# Altium schematic sheet Power.SchDoc: Power Supply
size A4; DrawnBy: A. Küllenberg; Revision: A; SheetNumber: 3; SheetTotal: 10
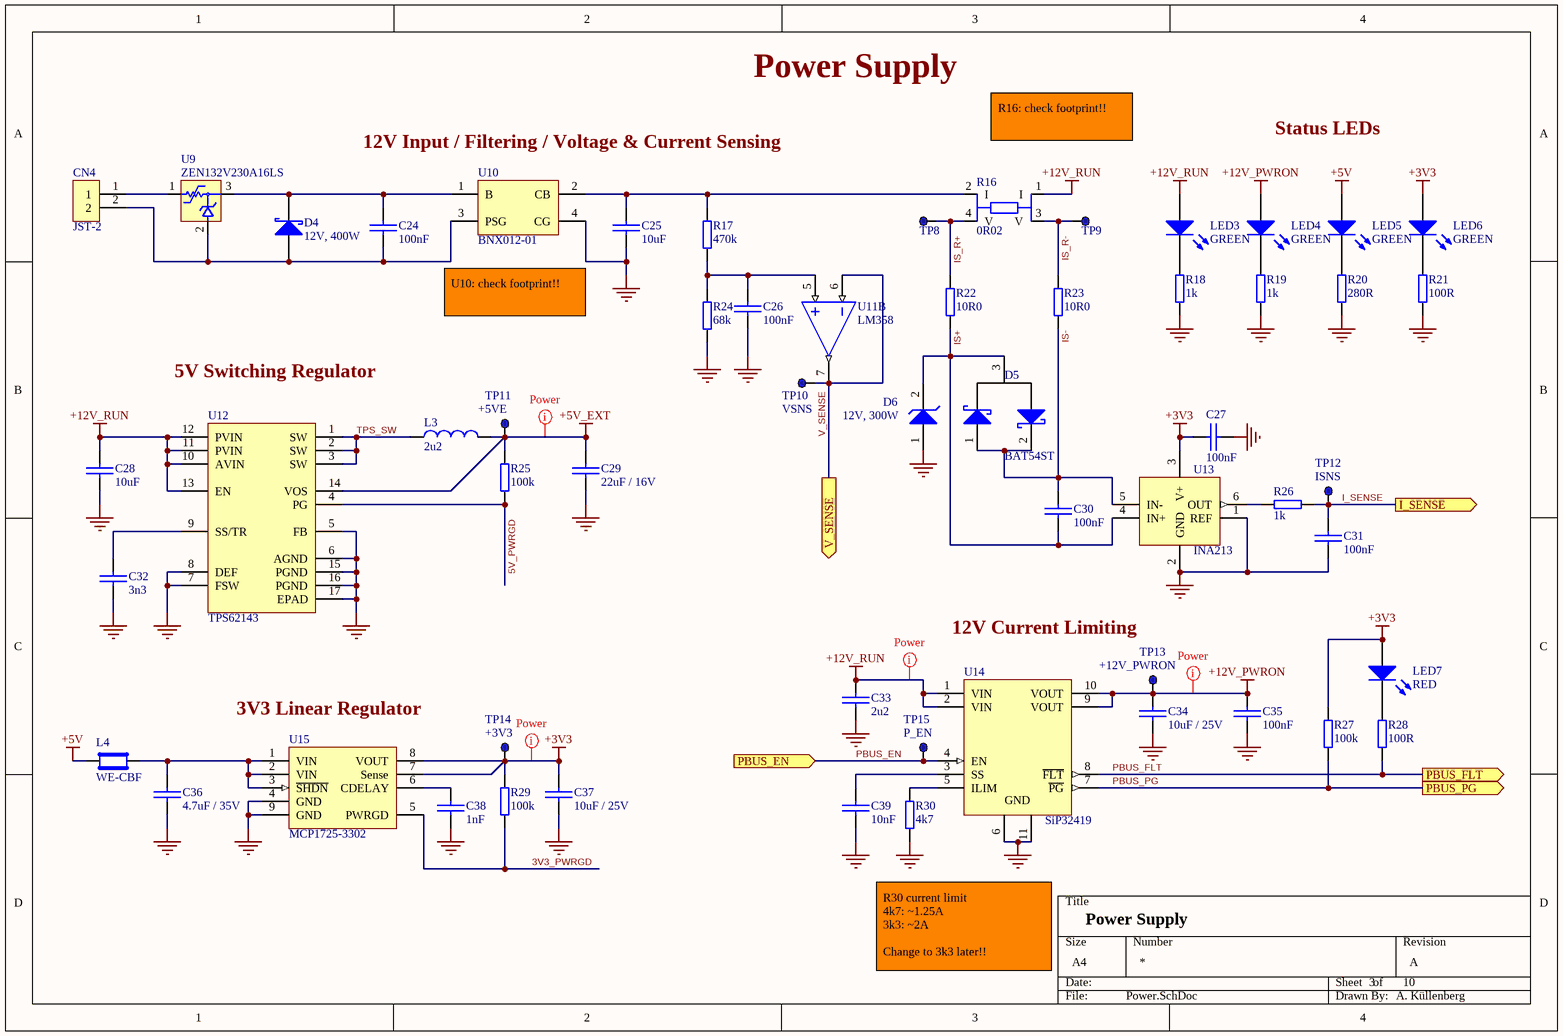
[diagram p0: Power.SchDoc]

## Parts
C24  100nF  [C0805]
C25  10uF  [C1206]
C26  100nF  [C0603]
C27  100nF  [C0603]
C28  10uF  [C1206]
C29  22uF / 16V  [C0805]
C30  100nF  [C0603]
C31  100nF  [C0603]
C32  3n3  [C0603]
C33  2u2  [C0805]
C34  10uF / 25V  [C0603]
C35  100nF  [C0603]
C36  4.7uF / 35V  [C0805]
C37  10uF / 25V  [C0603]
C38  1nF  [C0603]
C39  10nF  [C0603]
CN4  JST-2  [JST-2]
D4  12V, 400W  [DO-214AC]
D5  BAT54ST  [SOT-523]
D6  12V, 300W  [SOD523]
L3  2u2  [IHLP-1212BZ-11]
L4  WE-CBF  [L0805]
LED3  GREEN  [LED_0603_GREEN]
LED4  GREEN  [LED_0603_GREEN]
LED5  GREEN  [LED_0603_GREEN]
LED6  GREEN  [LED_0603_GREEN]
LED7  RED  [LED_0603_RED]
R16  0R02  [LVK12]
R17  470k  [R0603]
R18  1k  [R0603]
R19  1k  [R0603]
R20  280R  [R0603]
R21  100R  [R0603]
R22  10R0  [R0603]
R23  10R0  [R0603]
R24  68k  [R0603]
R25  100k  [R0603]
R26  1k  [R0603]
R27  100k  [R0603]
R28  100R  [R0603]
R29  100k  [R0603]
R30  4k7  [R0603]
TP8  ISR+  [TP_1mm]  (value not drawn)  (no BOM)
TP9  ISR-  [TP_1mm]  (value not drawn)  (no BOM)
TP10  VSNS  [TP_1mm]  (no BOM)
TP11  +5VE  [TP_1mm]  (no BOM)
TP12  ISNS  [TP_1mm]  (no BOM)
TP13  +12V_PWRON  [TP_1mm]  (no BOM)
TP14  +3V3  [TP_1mm]  (no BOM)
TP15  P_EN  [TP_1mm]  (no BOM)
U9  ZEN132V230A16LS  [ZEN132V230A16LS]
U10  BNX012-01  [BNX012-01]
U11  LM358  [DFN 2x2_LM358]  (part B of 2)
U12  TPS62143  [RGT0016C]
U13  INA213  [SC-70-6]
U14  SiP32419  [DFN 3x3_SiP324x9]
U15  MCP1725-3302  [QFN50P200X300X100_HS-9N]

## Ports
I_SENSE (out), PBUS_EN (in), PBUS_FLT (out), PBUS_PG (out), V_SENSE (out)

## Nets
+3V3: C27.1 C37.2 LED6.1(A) LED7.1(A) R27.2 R29.2 TP14.1 U13.3(V+) U15.7(Sense) U15.8(VOUT)
+5V: L4.1 LED5.1(A)
+5V_EXT: C29.2 L3.2 R25.2 TP11.1 U12.14(VOS)
+12V_PWRON: C34.2 C35.2 LED4.1(A) TP13.1 U14.9(VOUT) U14.10(VOUT)
+12V_RUN: C28.2 C33.2 LED3.1(A) R16.1(I) U12.10(AVIN) U12.11(PVIN) U12.12(PVIN) U12.13(EN) U14.1(VIN) U14.2(VIN)
GND: C25.1 C26.1 C27.2 C28.1 C29.1 C31.1 C32.1 C33.1 C34.1 C35.1 C36.1 C37.1 C38.1 C39.1 D6.1(A) R18.1 R19.1 R20.1 R21.1 R24.1 R30.1 U10.4(CG) U12.5(FB) U12.6(AGND) U12.7(FSW) U12.8(DEF) U12.15(PGND) U12.16(PGND) U12.17(EPAD) U13.1(REF) U13.2(GND) U14.6(GND) U14.11(GND) U15.4(GND) U15.9(GND)
3V3_PWRGD: R29.1 U15.5(PWRGD)
5V_PWRGD: R25.1 U12.4(PG)
I_SENSE: C31.2 R26.2 TP12.1 ; port I_SENSE
IS+: C30.1 D5.3(COM) D6.2(K) R22.1 U13.4(IN+)
IS-: C30.2 D5.1(A) D5.2(K) R23.1 U13.5(IN-)
IS_R+: R16.4(V) R22.2 TP8.1
IS_R-: R16.3(V) R23.2 TP9.1
PBUS_EN: TP15.1 U14.4(EN) ; port PBUS_EN
PBUS_FLT: R28.1 U14.8(~{FLT}) ; port PBUS_FLT
PBUS_PG: R27.1 U14.7(~{PG}) ; port PBUS_PG
TPS_SW: L3.1 U12.1(SW) U12.2(SW) U12.3(SW)
V_SENSE: TP10.1 U11.6(IN-) U11.7(OUT) ; port V_SENSE
NetC24_1: C24.1 CN4.2 D4.1(A) U9.2 U10.3(PSG)
NetC24_2: C24.2 D4.2(K) U9.3 U10.1(B)
NetC25_2: C25.2 R16.2(I) R17.2 U10.2(CB)
NetC26_2: C26.2 R17.1 R24.2 U11.5(IN+)
NetC32_2: C32.2 U12.9(SS/TR)
NetC36_2: C36.2 L4.2 U15.1(VIN) U15.2(VIN) U15.3(~{SHDN})
NetC38_2: C38.2 U15.6(CDELAY)
NetC39_2: C39.2 U14.3(SS)
NetCN4_1: CN4.1 U9.1
NetLED3_2: LED3.2(K) R18.2
NetLED4_2: LED4.2(K) R19.2
NetLED5_2: LED5.2(K) R20.2
NetLED6_2: LED6.2(K) R21.2
NetLED7_2: LED7.2(K) R28.2
NetR26_1: R26.1 U13.6(OUT)
NetR30_2: R30.2 U14.5(ILIM)

## Layout directives
net class Power: +3V3, +5V_EXT, +12V_PWRON, +12V_RUN

## Notes on the sheet
- Power Supply
- (near U10) 12V Input / Filtering / Voltage & Current Sensing
- R16: check footprint!!
- Status LEDs
- U10: check footprint!!
- 5V Switching Regulator
- 12V Current Limiting
- (near U15) 3V3 Linear Regulator
- R30 current limit
  4k7: ~1.25A
  3k3: ~2A
  Change to 3k3 later!!

## Library data of the parts
C24 = C0805C104K5RACTU: CAP CER 0.1UF 50V 10% X7R 0805; Manufacturer: Kemet; Capacitance: 0.1µF; Part Number: C0805C104K5RACTU; Value: 100nF; Supplier 1: Digi-Key; Supplier Part Number 1: 399-1170-1-ND; Manufacturer Part Number: C0805C104K5RACTU; RoHS: RoHS Compliant; Category: Capacitors; Stock 1: 3780914; Pricing 1: 1=0.1, 10=0.048, 25=0.034, 50=0.026, 100=0.0219, 250=0.018, 1000=0.01176 (EUR); Packaging: Cut Tape (CT); Tolerance: ±10%; Voltage - Rated: 50V; Temperature Coefficient: X7R; Mounting Type: Surface Mount, MLCC; Operating Temperature: -55°C ~ 125°C; Applications: General Purpose; Ratings: -; Package / Case: 0805 (2012 Metric); Size / Dimension: 0.079" L x 0.049" W (2.00mm x 1.25mm); Height - Seated (Max): -; Thickness (Max): 0.035" (0.88mm); Lead Spacing: -; Features: -; Lead Style: -; ComponentLink1URL: http://www.kemet.com/docfinder?Partnumber=C0805C104K5RACTU; ComponentLink1Description: http://www.kemet.com/docfinder?Partnumber=C0805C104K5RACTU
C25 C28 = GMK316AB7106KL-TR: CAP CER 10UF 35V X7R 1206; Manufacturer: Taiyo Yuden; Capacitance: 10µF; Tolerance: ±10%; Part Number: GMK316AB7106KL-TR; Value: 10uF; Supplier 1: Digi-Key; Supplier Part Number 1: 587-3007-1-ND; Manufacturer Part Number: GMK316AB7106KL-TR; RoHS: RoHS Compliant; Category: Capacitors; Stock 1: 238293; Pricing 1: 1=0.45, 10=0.316, 25=0.2704, 50=0.2394, 100=0.2085, 250=0.1776, 500=0.15446, 1000=0.13128 (EUR); Packaging: Cut Tape (CT); Voltage - Rated: 35V; Temperature Coefficient: X7R; Mounting Type: Surface Mount, MLCC; Operating Temperature: -55°C ~ 125°C; Applications: General Purpose; Ratings: -; Package / Case: 1206 (3216 Metric); Size / Dimension: 0.126" L x 0.063" W (3.20mm x 1.60mm); Height - Seated (Max): -; Thickness (Max): 0.071" (1.80mm); Lead Spacing: -; Features: -; Lead Style: -; ComponentLink1URL: http://www.yuden.co.jp/productdata/catalog/en/mlcc06_e.pdf; ComponentLink1Description: http://www.yuden.co.jp/productdata/catalog/en/mlcc06_e.pdf; Part Status: Active
C26 C27 C30 C31 C35 = C0603C104K5RACTU: CAP CER 0.1UF 50V X7R 0603; Manufacturer: Kemet; Capacitance: 0.10µF; Tolerance: ±10%; Part Number: C0603C104K5RACTU; Value: 100nF; Supplier 1: Digi-Key; Supplier Part Number 1: 399-5089-1-ND; Manufacturer Part Number: C0603C104K5RACTU; RoHS: RoHS Compliant; Category: Capacitors; Stock 1: 1628757; Pricing 1: 1=0.09, 10=0.037, 50=0.0198, 100=0.0167, 250=0.01372, 500=0.01174, 1000=0.00914 (EUR); Packaging: Cut Tape (CT); Voltage - Rated: 50V; Temperature Coefficient: X7R; Mounting Type: Surface Mount, MLCC; Operating Temperature: -55°C ~ 125°C; Applications: General Purpose; Ratings: -; Package / Case: 0603 (1608 Metric); Size / Dimension: 0.063" L x 0.031" W (1.60mm x 0.80mm); Height - Seated (Max): -; Thickness (Max): 0.034" (0.87mm); Lead Spacing: -; Features: -; Lead Style: -; ComponentLink1URL: http://www.kemet.com/docfinder?Partnumber=C0603C104K5RACTU; ComponentLink1Description: http://www.kemet.com/docfinder?Partnumber=C0603C104K5RACTU
C29 = C2012X5R1C226M085AC: CAP CER 22UF 16V X5R 0805; Manufacturer: TDK Corporation; Capacitance: 22µF; Tolerance: ±20%; Part Number: C2012X5R1C226M085AC; Value: 22uF / 16V; Supplier 1: Digi-Key; Supplier Part Number 1: 445-14374-1-ND; Manufacturer Part Number: C2012X5R1C226M085AC; RoHS: RoHS Compliant; Category: Capacitors; Stock 1: 125598; Pricing 1: 1=0.67, 10=0.639, 100=0.3099, 250=0.25744, 500=0.2336, 1000=0.21452 (EUR); Packaging: Cut Tape (CT); Voltage - Rated: 16V; Temperature Coefficient: X5R; Mounting Type: Surface Mount, MLCC; Operating Temperature: -55°C ~ 85°C; Applications: General Purpose; Ratings: -; Package / Case: 0805 (2012 Metric); Size / Dimension: 0.079" L x 0.049" W (2.00mm x 1.25mm); Height - Seated (Max): -; Thickness (Max): 0.039" (1.00mm); Lead Spacing: -; Features: Low ESL; Lead Style: -; ComponentLink1URL: https://product.tdk.com/info/en/catalog/datasheets/mlcc_commercial_general_en.pdf; ComponentLink1Description: https://product.tdk.com/info/en/catalog/datasheets/mlcc_commercial_general_en.pdf; Part Status: Active; Failure Rate: -
C32 = CL10B332KB8SFNC: CAP CER 3300PF 50V X7R 0603; Manufacturer: Samsung Electro-Mechanics America, Inc.; Tolerance: ±10%; Part Number: CL10B332KB8SFNC; Value: 3n3; Supplier 1: Digi-Key; Supplier Part Number 1: 1276-2034-1-ND; Manufacturer Part Number: CL10B332KB8SFNC; RoHS: RoHS Compliant; Category: Capacitors; Stock 1: 16204; Pricing 1: 1=0.09, 10=0.029, 100=0.0133, 500=0.00944, 1000=0.00743 (EUR); Packaging: Cut Tape (CT); Capacitance: 3300pF; Voltage - Rated: 50V; Temperature Coefficient: X7R; Mounting Type: Surface Mount, MLCC; Operating Temperature: -55°C ~ 125°C; Applications: Boardflex Sensitive; Ratings: -; Package / Case: 0603 (1608 Metric); Size / Dimension: 0.063" L x 0.031" W (1.60mm x 0.80mm); Height - Seated (Max): -; Thickness (Max): 0.035" (0.90mm); Lead Spacing: -; Features: Soft Termination; Lead Style: -; ComponentLink1URL: http://media.digikey.com/pdf/Data%20Sheets/Samsung%20PDFs/CL_Series_MLCC_ds.pdf; ComponentLink1Description: http://media.digikey.com/pdf/Data%20Sheets/Samsung%20PDFs/CL_Series_MLCC_ds.pdf; Part Status: Active
C33 = UMK212BB7225KG-T: CAP CER 2.2UF 50V X7R 0805; Manufacturer: Taiyo Yuden; Part Number: UMK212BB7225KG-T; Value: 2u2; Supplier 1: Digi-Key; Supplier Part Number 1: 587-3169-1-ND; Manufacturer Part Number: UMK212BB7225KG-T; RoHS: RoHS Compliant; Category: Capacitors; Stock 1: 394207; Pricing 1: 1=0.23, 10=0.159, 25=0.1264, 50=0.1054, 100=0.0897, 250=0.0712, 500=0.0633, 1000=0.05539 (EUR); Packaging: Cut Tape (CT)
C34 C37 = ZRB18AR61E106ME01L: CAP CER 10UF 25V X5R 0603; Manufacturer: Murata Electronics North America; Capacitance: 10µF; Tolerance: ±20%; Part Number: ZRB18AR61E106ME01L; Value: 10uF / 25V; Supplier 1: Digi-Key; Supplier Part Number 1: 490-10991-1-ND; Manufacturer Part Number: ZRB18AR61E106ME01L; RoHS: RoHS Compliant; Category: Capacitors; Stock 1: 23575; Pricing 1: 1=0.4, 10=0.278, 25=0.2284, 50=0.195, 100=0.1671, 250=0.13924, 500=0.12532, 1000=0.10583 (EUR); Packaging: Cut Tape (CT); Voltage - Rated: 25V; Temperature Coefficient: X5R; Mounting Type: Surface Mount, MLCC; Operating Temperature: -55°C ~ 85°C; Applications: Acoustic Noise Reduction; Ratings: -; Package / Case: 0603 (1608 Metric); Size / Dimension: 0.063" L x 0.031" W (1.60mm x 0.80mm); Height - Seated (Max): -; Thickness (Max): 0.047" (1.20mm); Lead Spacing: -; Features: Interposer Termination; Lead Style: -; ComponentLink1URL: http://search.murata.co.jp/Ceramy/image/img/A01X/G101/ENG/ZRB18AR61E106ME01-01.pdf; ComponentLink1Description: http://search.murata.co.jp/Ceramy/image/img/A01X/G101/ENG/ZRB18AR61E106ME01-01.pdf; Part Status: Active
C36 = C2012X7R1V475K125AE: CAP CER 4.7UF 35V X7R 0805; Manufacturer: TDK Corporation; Capacitance: 4.7µF; Tolerance: ±10%; Part Number: C2012X7R1V475K125AE; Value: 4.7uF / 35V; Supplier 1: Digi-Key; Supplier Part Number 1: 445-172489-1-ND; Manufacturer Part Number: C2012X7R1V475K125AE; RoHS: RoHS Compliant; Category: Capacitors; Stock 1: 7500; Pricing 1: 1=0.67, 10=0.639, 100=0.3099, 250=0.25744, 500=0.2336, 1000=0.21452 (EUR); Packaging: Cut Tape (CT); Voltage - Rated: 35V; Temperature Coefficient: X7R; Mounting Type: Surface Mount, MLCC; Operating Temperature: -55°C ~ 125°C; Applications: Boardflex Sensitive; Ratings: -; Package / Case: 0805 (2012 Metric); Size / Dimension: 0.079" L x 0.049" W (2.00mm x 1.25mm); Height - Seated (Max): -; Thickness (Max): 0.059" (1.50mm); Lead Spacing: -; Features: Soft Termination; Lead Style: -; ComponentLink1URL: https://product.tdk.com/info/en/catalog/datasheets/mlcc_commercial_soft_en.pdf; ComponentLink1Description: https://product.tdk.com/info/en/catalog/datasheets/mlcc_commercial_soft_en.pdf; Part Status: Active; Failure Rate: -
C38 = C0603C102K5RACTU: CAP CER 1000PF 50V X7R 0603; Manufacturer: Kemet; Tolerance: ±10%; Part Number: C0603C102K5RACTU; Value: 1nF; Supplier 1: Digi-Key; Supplier Part Number 1: 399-1082-1-ND; Manufacturer Part Number: C0603C102K5RACTU; RoHS: RoHS Compliant; Category: Capacitors; Stock 1: 703699; Pricing 1: 1=0.09, 10=0.021, 50=0.0116, 100=0.0099, 250=0.00808, 500=0.0069, 1000=0.00537 (EUR); Packaging: Cut Tape (CT); Capacitance: 1000pF; Voltage - Rated: 50V; Temperature Coefficient: X7R; Mounting Type: Surface Mount, MLCC; Operating Temperature: -55°C ~ 125°C; Applications: General Purpose; Ratings: -; Package / Case: 0603 (1608 Metric); Size / Dimension: 0.063" L x 0.031" W (1.60mm x 0.80mm); Height - Seated (Max): -; Thickness (Max): 0.034" (0.87mm); Lead Spacing: -; Features: -; Lead Style: -; ComponentLink1URL: http://www.kemet.com/docfinder?Partnumber=C0603C102K5RACTU; ComponentLink1Description: http://www.kemet.com/docfinder?Partnumber=C0603C102K5RACTU
C39 = 06035C103KAT2A: CAP CER 10000PF 50V X7R 0603; Manufacturer: AVX Corporation; Tolerance: ±10%; Part Number: 06035C103KAT2A; Value: 10nF; Supplier 1: Digi-Key; Supplier Part Number 1: 478-1227-1-ND; Manufacturer Part Number: 06035C103KAT2A; RoHS: RoHS Compliant; Category: Capacitors; Stock 1: 1245318; Pricing 1: 1=0.09, 10=0.017, 100=0.0079, 250=0.00644, 500=0.00552, 1000=0.0043 (EUR); Packaging: Cut Tape (CT); Capacitance: 10000pF; Voltage - Rated: 50V; Temperature Coefficient: X7R; Mounting Type: Surface Mount, MLCC; Operating Temperature: -55°C ~ 125°C; Applications: General Purpose; Ratings: -; Package / Case: 0603 (1608 Metric); Size / Dimension: 0.063" L x 0.032" W (1.60mm x 0.81mm); Height - Seated (Max): -; Thickness (Max): 0.035" (0.90mm); Lead Spacing: -; Features: -; Lead Style: -; ComponentLink1URL: http://datasheets.avx.com/X7RDielectric.pdf; ComponentLink1Description: http://datasheets.avx.com/X7RDielectric.pdf
CN4 = B2B-XH-A(LF)(SN): CONN HEADER XH TOP 2POS 2.5MM; Manufacturer: JST Sales America Inc.; Number of Positions: 2; Number of Positions Loaded: All; Current Rating: 3A; Voltage Rating: 250V; Pitch - Mating: 0.098" (2.50mm); Shrouding: Shrouded - 4 Wall; Style: Board to Cable/Wire; Contact Length - Post: 0.134" (3.40mm); Material Flammability Rating: UL94 V-0; Mated Stacking Heights: 9.8mm; Part Number: B2B-XH-A(LF)(SN); Value: JST-2; Supplier 1: Digi-Key; Supplier Part Number 1: 455-2247-ND; Manufacturer Part Number: B2B-XH-A(LF)(SN); RoHS: RoHS Compliant; Category: Connectors, Interconnects; Stock 1: 212920; Pricing 1: 1=0.14, 10=0.133, 100=0.0819, 500=0.0678, 1000=0.05932, 5000=0.05085, 10000=0.04944 (EUR); Packaging: Bulk; Connector Type: Header; Contact Type: Male Pin; Number of Rows: 1; Mounting Type: Through Hole; Termination: Press-Fit, Solder; Fastening Type: Detent Lock; Features: -; ComponentLink1URL: http://www.jst-mfg.com/product/pdf/eng/eXH.pdf; ComponentLink1Description: http://www.jst-mfg.com/product/pdf/eng/eXH.pdf; Contact Material: Brass; Operating Temperature: -25°C ~ 85°C; Part Status: Active; Row Spacing - Mating: -; Contact Length - Mating: -; Contact Finish - Mating: Tin; Contact Finish Thickness - Mating: -; Insulation Color: Natural; Overall Contact Length: -; Insulation Height: 0.276" (7.00mm); Contact Shape: Square; Ingress Protection: -; Contact Finish - Post: Tin; Insulation Material: Polyamide (PA66), Nylon 6/6; Contact Finish Thickness - Post: -; Applications: -
D4 = SMAJ12A-TR: TVS DIODE 12VWM 25.3VC SMA; Manufacturer: STMicroelectronics; Type: Zener; Voltage - Breakdown (Min): 13.3V; Voltage - Clamping (Max) @ Ipp: 25.3V; Current - Peak Pulse (10/1000µs): 91A (8/20µs); Power Line Protection: No; Part Number: SMAJ12A-TR; Value: 12V, 400W; Supplier 1: Digi-Key; Supplier Part Number 1: 497-6503-1-ND; Manufacturer Part Number: SMAJ12A-TR; RoHS: RoHS Compliant; Category: Circuit Protection; Stock 1: 9046; Pricing 1: 1=0.36, 10=0.273, 100=0.1699, 500=0.11628, 1000=0.08945 (EUR); Packaging: Cut Tape (CT); Operating Temperature: -55°C ~ 150°C (TJ); Mounting Type: Surface Mount; Package / Case: DO-214AC, SMA; Supplier Device Package: SMA (DO-214AC); ComponentLink1URL: http://www.st.com/content/ccc/resource/technical/document/datasheet/ff/c0/80/cc/19/4c/45/af/CD00001333.pdf/files/CD00001333.pdf/_jcr_content/translations/en.CD00001333.pdf; ComponentLink1Description: http://www.st.com/content/ccc/resource/technical/document/datasheet/ff/c0/80/cc/19/4c/45/af/CD00001333.pdf/files/CD00001333.pdf/_jcr_content/translations/en.CD00001333.pdf; Voltage - Reverse Standoff (Typ): 12V; Power - Peak Pulse: 400W; Applications: General Purpose; Capacitance @ Frequency: -; Part Status: Active
D5 = BAT54ST-7-F: DIODE ARRAY SCHOTTKY 30V SOT523; Manufacturer: Diodes Incorporated; Current - Reverse Leakage @ Vr: 2µA @ 25V; Voltage - Forward (Vf) (Max) @ If: 1V @ 100mA; Speed: Small Signal =< 200mA (Io), Any Speed; Reverse Recovery Time (trr): 5ns; Diode Configuration: 1 Pair Series Connection; Current - Average Rectified (Io) (per Diode): 200mA (DC); Part Number: BAT54ST-7-F; Value: BAT54ST; Supplier 1: Digi-Key; Supplier Part Number 1: BAT54ST-FDICT-ND; Manufacturer Part Number: BAT54ST-7-F; RoHS: RoHS Compliant; Category: Discrete Semiconductor Products; Stock 1: 70475; Pricing 1: 1=0.44, 10=0.327, 100=0.185, 500=0.12252, 1000=0.09393 (EUR); Packaging: Cut Tape (CT); Mounting Type: Surface Mount; Package / Case: SOT-523; Supplier Device Package: SOT-523; ComponentLink1URL: http://www.diodes.com/_files/datasheets/ds30259.pdf; ComponentLink1Description: http://www.diodes.com/_files/datasheets/ds30259.pdf; Diode Type: Schottky; Voltage - DC Reverse (Vr) (Max): 30V; Operating Temperature - Junction: -65°C ~ 125°C; Part Status: Active
D6 = T12S5-7: TVS DIODE 12VWM 28VC SOD523; Manufacturer: Diodes Incorporated; Type: Zener; Voltage - Breakdown (Min): 14.1V; Voltage - Clamping (Max) @ Ipp: 28V; Current - Peak Pulse (10/1000µs): 12A (8/20µs); Power Line Protection: No; Capacitance @ Frequency: 60pF @ 1MHz; Part Number: T12S5-7; Value: 12V, 300W; Supplier 1: Digi-Key; Supplier Part Number 1: T12S5DICT-ND; Manufacturer Part Number: T12S5-7; RoHS: RoHS Compliant; Category: Circuit Protection; Stock 1: 4467; Pricing 1: 1=0.39, 10=0.291, 100=0.1811, 500=0.12388, 1000=0.09529 (EUR); Packaging: Cut Tape (CT); Operating Temperature: -65°C ~ 150°C (TJ); Mounting Type: Surface Mount; Package / Case: SC-79, SOD-523; Supplier Device Package: SOD-523; ComponentLink1URL: http://www.diodes.com/_files/datasheets/ds31112.pdf; ComponentLink1Description: http://www.diodes.com/_files/datasheets/ds31112.pdf; Voltage - Reverse Standoff (Typ): 12V; Power - Peak Pulse: 300W; Applications: General Purpose; Part Status: Active
L3 = IHLP1212BZER2R2M11: FIXED IND 2.2UH 3A 46 MOHM SMD; Manufacturer: Vishay Dale; Type: Molded; Inductance: 2.2µH; Tolerance: ±20%; Current - Saturation: 3.3A; Shielding: Shielded; DC Resistance (DCR): 46 mOhm Max; Frequency - Self Resonant: 55MHz; Frequency - Test: 100kHz; Part Number: IHLP1212BZER2R2M11; Value: 2u2; Supplier 1: Digi-Key; Supplier Part Number 1: 541-1322-1-ND; Manufacturer Part Number: IHLP1212BZER2R2M11; RoHS: RoHS Compliant; Category: Inductors, Coils, Chokes; Stock 1: 12797; Pricing 1: 1=1.33, 10=1.237, 25=1.142, 50=0.9516, 100=0.8944, 250=0.79932, 500=0.68512, 1000=0.60899 (EUR); Packaging: Cut Tape (CT); Part Status: Active; Material - Core: -; Current Rating: 3A; Q @ Freq: -; Ratings: -; Operating Temperature: -55°C ~ 125°C; Mounting Type: Surface Mount; Package / Case: Nonstandard; Supplier Device Package: -; Size / Dimension: 0.144" L x 0.118" W (3.65mm x 3.00mm); Height - Seated (Max): 0.079" (2.00mm); ComponentLink1URL: http://www.vishay.com/docs/34289/lp12bz11.pdf; ComponentLink1Description: http://www.vishay.com/docs/34289/lp12bz11.pdf
L4 = 742792040: FERRITE BEAD 600 OHM 0805 1LN; Manufacturer: Wurth Electronics Inc; Filter Type: Signal Line; Number of Lines: 1; Impedance @ Frequency: 600 Ohm @ 100MHz; Current Rating (Max): 2A; DC Resistance (DCR) (Max): 150 mOhm; Part Number: 742792040; Value: WE-CBF; Supplier 1: Digi-Key; Supplier Part Number 1: 732-1620-1-ND; Manufacturer Part Number: 742792040; RoHS: RoHS Compliant; Category: Filters; Stock 1: 168104; Pricing 1: 1=0.25, 50=0.2428, 100=0.2231, 500=0.2135, 1000=0.20382 (EUR); Packaging: Cut Tape (CT); Part Status: Active; Ratings: -; Operating Temperature: -55°C ~ 125°C; Package / Case: 0805 (2012 Metric); Mounting Type: Surface Mount; Height (Max): 0.043" (1.10mm); Size / Dimension: 0.079" L x 0.047" W (2.00mm x 1.20mm); ComponentLink1URL: http://katalog.we-online.de/pbs/datasheet/742792040.pdf; ComponentLink1Description: http://katalog.we-online.de/pbs/datasheet/742792040.pdf
LED3-LED6 = LTST-C190KGKT: LED GREEN CLEAR 0603 SMD; Manufacturer: Lite-On Inc.; Voltage - Forward (Vf) (Typ): 2V; Viewing Angle: 130°; Wavelength - Dominant: 571nm; Wavelength - Peak: 574nm; Millicandela Rating: 35mcd; Current - Test: 20mA; Lens Color: Colorless; Lens Style/Size: Rectangle with Flat Top, 1.10mm x 0.80mm; Part Number: LTST-C190KGKT; Value: GREEN; Supplier 1: Digi-Key; Supplier Part Number 1: 160-1435-1-ND; Manufacturer Part Number: LTST-C190KGKT; RoHS: RoHS Compliant; Category: Optoelectronics; Stock 1: 1245030; Pricing 1: 1=0.24, 10=0.176, 25=0.1296, 100=0.0926, 250=0.063, 500=0.05556, 1000=0.04353 (EUR); Packaging: Cut Tape (CT); Mounting Type: Surface Mount; Package / Case: 0603 (1608 Metric); ComponentLink1URL: http://optoelectronics.liteon.com/upload/download/DS22-2000-074/S_110_LTST-C190KGKT.pdf; ComponentLink1Description: http://optoelectronics.liteon.com/upload/download/DS22-2000-074/S_110_LTST-C190KGKT.pdf; Supplier Device Package: *; Color: Green; Lens Transparency: Clear; Size / Dimension: 1.60mm L x 0.80mm W; Height (Max): 0.80mm; Features: -
LED7 = LTST-C190KRKT: LED RED CLEAR 0603 SMD; Manufacturer: Lite-On Inc.; Voltage - Forward (Vf) (Typ): 2V; Viewing Angle: 130°; Wavelength - Dominant: 631nm; Wavelength - Peak: 639nm; Millicandela Rating: 99mcd; Current - Test: 20mA; Lens Color: Colorless; Lens Style/Size: Rectangle with Flat Top, 1.10mm x 0.80mm; Part Number: LTST-C190KRKT; Value: RED; Supplier 1: Digi-Key; Supplier Part Number 1: 160-1436-1-ND; Manufacturer Part Number: LTST-C190KRKT; RoHS: RoHS Compliant; Category: Optoelectronics; Stock 1: 1183099; Pricing 1: 1=0.24, 10=0.176, 25=0.1296, 100=0.0926, 250=0.063, 500=0.05556, 1000=0.04353 (EUR); Packaging: Cut Tape (CT); Mounting Type: Surface Mount; Package / Case: 0603 (1608 Metric); ComponentLink1URL: http://optoelectronics.liteon.com/upload/download/DS-22-99-0151/S_110_LTST-C190KRKT.pdf; ComponentLink1Description: http://optoelectronics.liteon.com/upload/download/DS-22-99-0151/S_110_LTST-C190KRKT.pdf; Supplier Device Package: *; Color: Red; Lens Transparency: Clear; Size / Dimension: 1.60mm L x 0.80mm W; Height (Max): 0.80mm; Features: -
R16 = LVK12R020DER: RES SMD 0.02 OHM 0.5% 1/2W 1206; Manufacturer: Ohmite; Resistance (Ohms): 0.02; Power (Watts): 0.5W, 1/2W; Temperature Coefficient: ±50ppm/°C; Part Number: LVK12R020DER; Value: 0R02; Manufacturer Part Number: LVK12R020DER; RoHS: RoHS Compliant; Category: Resistors; Stock 1: 30090; Pricing 1: 1=0.81, 10=0.709, 25=0.6228, 50=0.569, 100=0.4939, 250=0.42948, 500=0.35648 (EUR); Packaging: Cut Tape (CT); Tolerance: ±0.5%; Composition: Thick Film; Features: Anti-Corrosive, Current Sense, Moisture Resistant; Operating Temperature: -40°C ~ 125°C; Package / Case: 1206 (3216 Metric); Supplier Device Package: 1206; Size / Dimension: 0.126" L x 0.063" W (3.20mm x 1.60mm); ComponentLink1URL: http://www.ohmite.com/cat/res_lvk.pdf; ComponentLink1Description: http://www.ohmite.com/cat/res_lvk.pdf; Supplier 1: Digi-Key; Supplier Part Number 1: LVK12R020DERCT-ND; Height - Seated (Max): 0.026" (0.65mm); Part Status: Active; Failure Rate: -
R17 = RC0603FR-07470KL: RES SMD 470K OHM 1% 1/10W 0603; Manufacturer: Yageo; Power (Watts): 0.1W, 1/10W; Temperature Coefficient: ±100ppm/°C; Part Number: RC0603FR-07470KL; Value: 470k; Manufacturer Part Number: RC0603FR-07470KL; RoHS: RoHS Compliant; Category: Resistors; Stock 1: 827544; Pricing 1: 1=0.09, 10=0.012, 25=0.0088, 50=0.0066, 100=0.0049, 250=0.00372, 500=0.00298, 1000=0.0022 (EUR); Packaging: Cut Tape (CT); Resistance (Ohms): 470k; Tolerance: ±1%; Composition: Thick Film; Features: Moisture Resistant; Operating Temperature: -55°C ~ 155°C; Package / Case: 0603 (1608 Metric); Supplier Device Package: 0603; Size / Dimension: 0.063" L x 0.031" W (1.60mm x 0.80mm); ComponentLink1URL: http://www.yageo.com/documents/recent/PYu-RC_Group_51_RoHS_L_7.pdf; ComponentLink1Description: http://www.yageo.com/documents/recent/PYu-RC_Group_51_RoHS_L_7.pdf; Supplier 1: Digi-Key; Supplier Part Number 1: 311-470KHRCT-ND; Height - Seated (Max): 0.022" (0.55mm); Part Status: Active; Failure Rate: -
R18 R19 R26 = CRCW06031K00FKEA: RES SMD 1K OHM 1% 1/10W 0603; Manufacturer: Vishay Dale; Power (Watts): 0.1W, 1/10W; Temperature Coefficient: ±100ppm/°C; Part Number: CRCW06031K00FKEA; Value: 1k; Manufacturer Part Number: CRCW06031K00FKEA; RoHS: RoHS Compliant; Category: Resistors; Stock 1: 862886; Pricing 1: 1=0.09, 10=0.027, 25=0.0196, 50=0.015, 100=0.011, 250=0.0084, 500=0.00674, 1000=0.00496, 2500=0.00431 (EUR); Packaging: Cut Tape (CT); Resistance (Ohms): 1k; Tolerance: ±1%; Composition: Thick Film; Features: Automotive AEC-Q200; Operating Temperature: -55°C ~ 155°C; Package / Case: 0603 (1608 Metric); Supplier Device Package: 0603; Size / Dimension: 0.061" L x 0.033" W (1.55mm x 0.85mm); Height: 0.020" (0.50mm); Number of Terminations: 2; ComponentLink1URL: http://www.vishay.com/docs/20035/dcrcwe3.pdf; ComponentLink1Description: http://www.vishay.com/docs/20035/dcrcwe3.pdf; Supplier 1: Digi-Key; Supplier Part Number 1: 541-1.00KHCT-ND
R20 = RC0603FR-07280RL: RES SMD 280 OHM 1% 1/10W 0603; Manufacturer: Yageo; Resistance (Ohms): 280; Power (Watts): 0.1W, 1/10W; Temperature Coefficient: ±100ppm/°C; Part Number: RC0603FR-07280RL; Value: 280R; Manufacturer Part Number: RC0603FR-07280RL; RoHS: RoHS Compliant; Category: Resistors; Stock 1: 47; Pricing 1: 1=0.09, 10=0.012, 25=0.0088, 50=0.0066, 100=0.0049, 250=0.00372, 500=0.00298, 1000=0.0022 (EUR); Packaging: Cut Tape (CT); Tolerance: ±1%; Composition: Thick Film; Features: Moisture Resistant; Operating Temperature: -55°C ~ 155°C; Package / Case: 0603 (1608 Metric); Supplier Device Package: 0603; Size / Dimension: 0.063" L x 0.031" W (1.60mm x 0.80mm); ComponentLink1URL: http://www.yageo.com/documents/recent/PYu-RC_Group_51_RoHS_L_6.pdf; ComponentLink1Description: http://www.yageo.com/documents/recent/PYu-RC_Group_51_RoHS_L_6.pdf; Supplier 1: Digi-Key; Supplier Part Number 1: 311-280HRCT-ND; Height - Seated (Max): 0.022" (0.55mm); Part Status: Active; Failure Rate: -
R21 R28 = RC0603JR-07100RL: RES SMD 100 OHM 5% 1/10W 0603; Manufacturer: Yageo; Resistance (Ohms): 100; Power (Watts): 0.1W, 1/10W; Temperature Coefficient: ±100ppm/°C; Part Number: RC0603JR-07100RL; Value: 100R; Manufacturer Part Number: RC0603JR-07100RL; RoHS: RoHS Compliant; Category: Resistors; Stock 1: 1530379; Pricing 1: 1=0.09, 10=0.009, 25=0.0072, 50=0.0054, 100=0.0039, 250=0.003, 500=0.00242, 1000=0.00177 (EUR); Packaging: Cut Tape (CT); Tolerance: ±5%; Composition: Thick Film; Features: Moisture Resistant; Operating Temperature: -55°C ~ 155°C; Package / Case: 0603 (1608 Metric); Supplier Device Package: 0603; Size / Dimension: 0.063" L x 0.031" W (1.60mm x 0.80mm); ComponentLink1URL: http://www.yageo.com/documents/recent/PYu-RC_Group_51_RoHS_L_7.pdf; ComponentLink1Description: http://www.yageo.com/documents/recent/PYu-RC_Group_51_RoHS_L_7.pdf; Supplier 1: Digi-Key; Supplier Part Number 1: 311-100GRCT-ND; Height - Seated (Max): 0.022" (0.55mm); Part Status: Active; Failure Rate: -
R22 R23 = CRCW060310R0FKEA: RES SMD 10 OHM 1% 1/10W 0603; Manufacturer: Vishay Dale; Resistance (Ohms): 10; Power (Watts): 0.1W, 1/10W; Temperature Coefficient: ±100ppm/°C; Part Number: CRCW060310R0FKEA; Value: 10R0; Manufacturer Part Number: CRCW060310R0FKEA; RoHS: RoHS Compliant; Category: Resistors; Stock 1: 261638; Pricing 1: 1=0.09, 10=0.027, 25=0.0196, 50=0.015, 100=0.011, 250=0.0084, 500=0.00674, 1000=0.00496, 2500=0.00431 (EUR); Packaging: Cut Tape (CT); Tolerance: ±1%; Composition: Thick Film; Features: Automotive AEC-Q200; Operating Temperature: -55°C ~ 155°C; Package / Case: 0603 (1608 Metric); Supplier Device Package: 0603; Size / Dimension: 0.061" L x 0.033" W (1.55mm x 0.85mm); Height: 0.020" (0.50mm); Number of Terminations: 2; ComponentLink1URL: http://www.vishay.com/docs/20035/dcrcwe3.pdf; ComponentLink1Description: http://www.vishay.com/docs/20035/dcrcwe3.pdf; Supplier 1: Digi-Key; Supplier Part Number 1: 541-10.0HCT-ND
R24 = RC0603FR-0768KL: RES SMD 68K OHM 1% 1/10W 0603; Manufacturer: Yageo; Power (Watts): 0.1W, 1/10W; Temperature Coefficient: ±100ppm/°C; Part Number: RC0603FR-0768KL; Value: 68k; Manufacturer Part Number: RC0603FR-0768KL; RoHS: RoHS Compliant; Category: Resistors; Stock 1: 748857; Pricing 1: 1=0.09, 10=0.012, 25=0.0088, 50=0.0066, 100=0.0049, 250=0.00372, 500=0.00298, 1000=0.0022 (EUR); Packaging: Cut Tape (CT); Resistance (Ohms): 68k; Tolerance: ±1%; Composition: Thick Film; Features: Moisture Resistant; Operating Temperature: -55°C ~ 155°C; Package / Case: 0603 (1608 Metric); Supplier Device Package: 0603; Size / Dimension: 0.063" L x 0.031" W (1.60mm x 0.80mm); ComponentLink1URL: http://www.yageo.com/documents/recent/PYu-RC_Group_51_RoHS_L_7.pdf; ComponentLink1Description: http://www.yageo.com/documents/recent/PYu-RC_Group_51_RoHS_L_7.pdf; Supplier 1: Digi-Key; Supplier Part Number 1: 311-68.0KHRCT-ND; Height - Seated (Max): 0.022" (0.55mm); Part Status: Active; Failure Rate: -
R25 R27 R29 = RC0603FR-07100KL: RES SMD 100K OHM 1% 1/10W 0603; Manufacturer: Yageo; Power (Watts): 0.1W, 1/10W; Temperature Coefficient: ±100ppm/°C; Part Number: RC0603FR-07100KL; Value: 100k; Manufacturer Part Number: RC0603FR-07100KL; RoHS: RoHS Compliant; Category: Resistors; Stock 1: 6595647; Pricing 1: 1=0.09, 10=0.012, 25=0.0088, 50=0.007, 100=0.0051, 250=0.00388, 500=0.0031, 1000=0.00229 (EUR); Packaging: Cut Tape (CT); Resistance (Ohms): 100k; Tolerance: ±1%; Composition: Thick Film; Features: Moisture Resistant; Operating Temperature: -55°C ~ 155°C; Package / Case: 0603 (1608 Metric); Supplier Device Package: 0603; Size / Dimension: 0.063" L x 0.031" W (1.60mm x 0.80mm); ComponentLink1URL: http://www.yageo.com/documents/recent/PYu-RC_Group_51_RoHS_L_7.pdf; ComponentLink1Description: http://www.yageo.com/documents/recent/PYu-RC_Group_51_RoHS_L_7.pdf; Supplier 1: Digi-Key; Supplier Part Number 1: 311-100KHRCT-ND; Height - Seated (Max): 0.022" (0.55mm); Part Status: Active; Failure Rate: -
R30 = CRCW06034K70FKEA: RES SMD 4.7K OHM 1% 1/10W 0603; Manufacturer: Vishay Dale; Power (Watts): 0.1W, 1/10W; Temperature Coefficient: ±100ppm/°C; Part Number: CRCW06034K70FKEA; Value: 4k7; Manufacturer Part Number: CRCW06034K70FKEA; RoHS: RoHS Compliant; Category: Resistors; Stock 1: 324271; Pricing 1: 1=0.09, 10=0.027, 25=0.0196, 50=0.015, 100=0.011, 250=0.0084, 500=0.00674, 1000=0.00496, 2500=0.00431 (EUR); Packaging: Cut Tape (CT); Resistance (Ohms): 4.7k; Tolerance: ±1%; Composition: Thick Film; Features: Automotive AEC-Q200; Operating Temperature: -55°C ~ 155°C; Package / Case: 0603 (1608 Metric); Supplier Device Package: 0603; Size / Dimension: 0.061" L x 0.033" W (1.55mm x 0.85mm); Height: 0.020" (0.50mm); Number of Terminations: 2; ComponentLink1URL: http://www.vishay.com/docs/20035/dcrcwe3.pdf; ComponentLink1Description: http://www.vishay.com/docs/20035/dcrcwe3.pdf; Supplier 1: Digi-Key; Supplier Part Number 1: 541-4.70KHCT-ND
TP8-TP15 = TP: Value: TP; Part Number: TP
U9 = ZEN132V230A16LS: POLYZEN 13.2V PPTC/ZENER SMD; Manufacturer: Littelfuse Inc.; Part Number: ZEN132V230A16LS; Value: ZEN132V230A16LS; Supplier 1: Digi-Key; Supplier Part Number 1: ZEN132V230A16LSCT-ND; Manufacturer Part Number: ZEN132V230A16LS; RoHS: RoHS Compliant; Category: Circuit Protection; Stock 1: 2047; Pricing 1: 1=1.81, 10=1.633, 25=1.4588, 100=1.3126, 250=1.1668, 500=1.02094, 1000=0.84592 (EUR); Packaging: Cut Tape (CT); Part Status: Active
U10 = BNX012-01: FILTER LC TH; Manufacturer: Murata Electronics North America; Filter Order: 5th; Number of Channels: 2; Attenuation Value: 40dB @ 1MHz ~ 1GHz; Current: 15A; ESD Protection: No; Voltage - Rated: 50V; Part Number: BNX012-01; Value: BNX012-01; Supplier 1: Digi-Key; Supplier Part Number 1: 490-5054-ND; Manufacturer Part Number: BNX012-01; RoHS: RoHS Compliant; Category: Filters; Stock 1: 5593; Pricing 1: 1=3.99, 10=3.59, 50=2.6324, 100=2.3133, 250=2.15376, 500=2.05004, 1000=1.9942 (EUR); Packaging: Bulk; Part Status: Active; Operating Temperature: -40°C ~ 125°C; Package / Case: Block, 4 Lead; Mounting Type: Through Hole; Size / Dimension: 0.472" L x 0.433" W (12.00mm x 11.00mm); ComponentLink1URL: http://media.digikey.com/pdf/Data%20Sheets/Murata%20PDFs/BNX_Series.pdf; ComponentLink1Description: http://media.digikey.com/pdf/Data%20Sheets/Murata%20PDFs/BNX_Series.pdf; Type: Low Pass; Technology: LC; Center / Cutoff Frequency: -; Resistance - Channel (Ohms): -; Values: -; Applications: Data Lines for Mobile Devices; Height: 0.335" (8.50mm)
U11 = LM358QT: IC OPAMP GP 1.1MHZ 8DFN; Manufacturer: STMicroelectronics; Amplifier Type: General Purpose; Number of Circuits: 2; Slew Rate: 0.6 V/µs; Current - Supply: 700µA; Current - Output / Channel: 60mA; Voltage - Supply, Single/Dual (±): 3 V ~ 30 V, ±1.5 V ~ 15 V; Part Number: LM358QT; Value: LM358; Supplier 1: Digi-Key; Supplier Part Number 1: 497-12007-1-ND; Manufacturer Part Number: LM358QT; RoHS: RoHS Compliant; Category: Integrated Circuits (ICs); Stock 1: 1511; Pricing 1: 1=0.43, 10=0.324, 100=0.2013, 500=0.13776, 1000=0.10596 (EUR); Packaging: Cut Tape (CT); Output Type: -; -3db Bandwidth: -; Operating Temperature: 0°C ~ 70°C; Mounting Type: Surface Mount; Package / Case: 8-UFDFN Exposed Pad; Supplier Device Package: 8-DFN (2x2); ComponentLink1URL: http://www.st.com/content/ccc/resource/technical/document/datasheet/61/46/87/01/98/ed/44/c5/CD00000464.pdf/files/CD00000464.pdf/jcr:content/translations/en.CD00000464.pdf; ComponentLink1Description: http://www.st.com/content/ccc/resource/technical/document/datasheet/61/46/87/01/98/ed/44/c5/CD00000464.pdf/files/CD00000464.pdf/jcr:content/translations/en.CD00000464.pdf; Part Status: Active
U12 = TPS62143RGTR: IC REG BUCK 5V 2A SYNC 16QFN; Manufacturer: Texas Instruments; Function: Step-Down; Output Configuration: Positive; Output Type: Fixed; Number of Outputs: 1; Voltage - Input (Min): 3V; Voltage - Input (Max): 17V; Frequency - Switching: 2.5MHz; Synchronous Rectifier: Yes; Part Number: TPS62143RGTR; Value: TPS62143; Supplier 1: Digi-Key; Supplier Part Number 1: 296-39448-1-ND; Manufacturer Part Number: TPS62143RGTR; RoHS: RoHS Compliant; Category: Integrated Circuits (ICs); Stock 1: 5425; Pricing 1: 1=2.19, 10=1.971, 100=1.5843, 500=1.3017, 1000=1.07855 (EUR); Packaging: Cut Tape (CT); Current - Output: 2A; Operating Temperature: -40°C ~ 85°C (TA); Mounting Type: Surface Mount; Package / Case: 16-VFQFN Exposed Pad; Supplier Device Package: 16-QFN (3x3); ComponentLink1URL: http://www.ti.com/lit/ds/symlink/tps62140.pdf; ComponentLink1Description: http://www.ti.com/lit/ds/symlink/tps62140.pdf; Part Status: Active; Topology: Buck; Voltage - Output (Min/Fixed): 5V; Voltage - Output (Max): -
U13 = INA213BIDCKR: IC OPAMP CURR SENSE 14KHZ SC70-6; Manufacturer: Texas Instruments; Amplifier Type: Current Sense; Number of Circuits: 1; Slew Rate: 0.4 V/µs; Current - Input Bias: 28µA; Voltage - Input Offset: 5µV; Current - Supply: 65µA; Voltage - Supply, Single/Dual (±): 2.7 V ~ 26 V; Part Number: INA213BIDCKR; Value: INA213; Supplier 1: Digi-Key; Supplier Part Number 1: 296-40129-1-ND; Manufacturer Part Number: INA213BIDCKR; RoHS: RoHS Compliant; Category: Integrated Circuits (ICs); Stock 1: 1363; Pricing 1: 1=1.44, 10=1.29, 100=1.0064, 500=0.83134, 1000=0.65632 (EUR); Packaging: Cut Tape (CT); Output Type: -; Gain Bandwidth Product: 14kHz; -3db Bandwidth: -; Current - Output / Channel: -; Operating Temperature: -40°C ~ 125°C; Mounting Type: Surface Mount; Package / Case: 6-TSSOP, SC-88, SOT-363; Supplier Device Package: SC-70-6; ComponentLink1URL: http://www.ti.com/lit/ds/symlink/ina210.pdf; ComponentLink1Description: http://www.ti.com/lit/ds/symlink/ina210.pdf; Part Status: Active
U14 = SIP32419DN-T1-GE4: LOAD SWITCH 3A 28V 10DFN; Manufacturer: Vishay Siliconix; Switch Type: General Purpose; Number of Outputs: 1; Output Configuration: High Side; Output Type: P-Channel; Interface: On/Off; Voltage - Load: 6 V ~ 28 V; Voltage - Supply (Vcc/Vdd): Not Required; Current - Output (Max): 3.5A; Rds On (Typ): 56 mOhm; Input Type: Non-Inverting; Fault Protection: Current Limiting (Adjustable), Over Temperature, UVLO; Part Number: SIP32419DN-T1-GE4; Value: SiP32419; Supplier 1: Digi-Key; Supplier Part Number 1: SIP32419DN-T1-GE4CT-ND; Manufacturer Part Number: SIP32419DN-T1-GE4; RoHS: RoHS Compliant; Category: Integrated Circuits (ICs); Stock 1: 3712; Pricing 1: 1=2.2, 10=1.978, 100=1.5866, 500=1.30406, 1000=1.07948 (EUR); Packaging: Cut Tape (CT); Features: Power Good, Slew Rate Controlled, Status Flag; Operating Temperature: -40°C ~ 85°C (TA); Package / Case: 10-VFDFN Exposed Pad; Supplier Device Package: 10-DFN (3x3); ComponentLink1URL: http://www.vishay.com/docs/63939/sip32429.pdf; ComponentLink1Description: http://www.vishay.com/docs/63939/sip32429.pdf
U15 = MCP1725-3302E/MC: IC REG LDO 3.3V 0.5A 8DFN; Manufacturer: Microchip Technology; Regulator Topology: Positive Fixed; Current - Output: 500mA; Voltage - Dropout (Typical): 0.21V @ 500mA; Voltage - Input: Up to 6V; Part Number: MCP1725-3302E/MC; Value: MCP1725-3302; Supplier 1: Digi-Key; Supplier Part Number 1: MCP1725-3302E/MC-ND; Manufacturer Part Number: MCP1725-3302E/MC; RoHS: RoHS Compliant; Category: Integrated Circuits (ICs); Stock 1: 1379; Pricing 1: 1=0.5, 25=0.418, 100=0.3792 (EUR); Packaging: Tube; Voltage - Output: 3.3V; Current - Limit (Min): -; Operating Temperature: -40°C ~ 125°C; Mounting Type: Surface Mount; Package / Case: 8-VFDFN Exposed Pad; Supplier Device Package: 8-DFN (2x3); ComponentLink1URL: http://www.microchip.com/mymicrochip/filehandler.aspx?ddocname=en520352; ComponentLink1Description: http://www.microchip.com/mymicrochip/filehandler.aspx?ddocname=en520352; Part Status: Active